# Altium project Pixhawk-BEC-Module.PrjPcb (part 1 of 3)
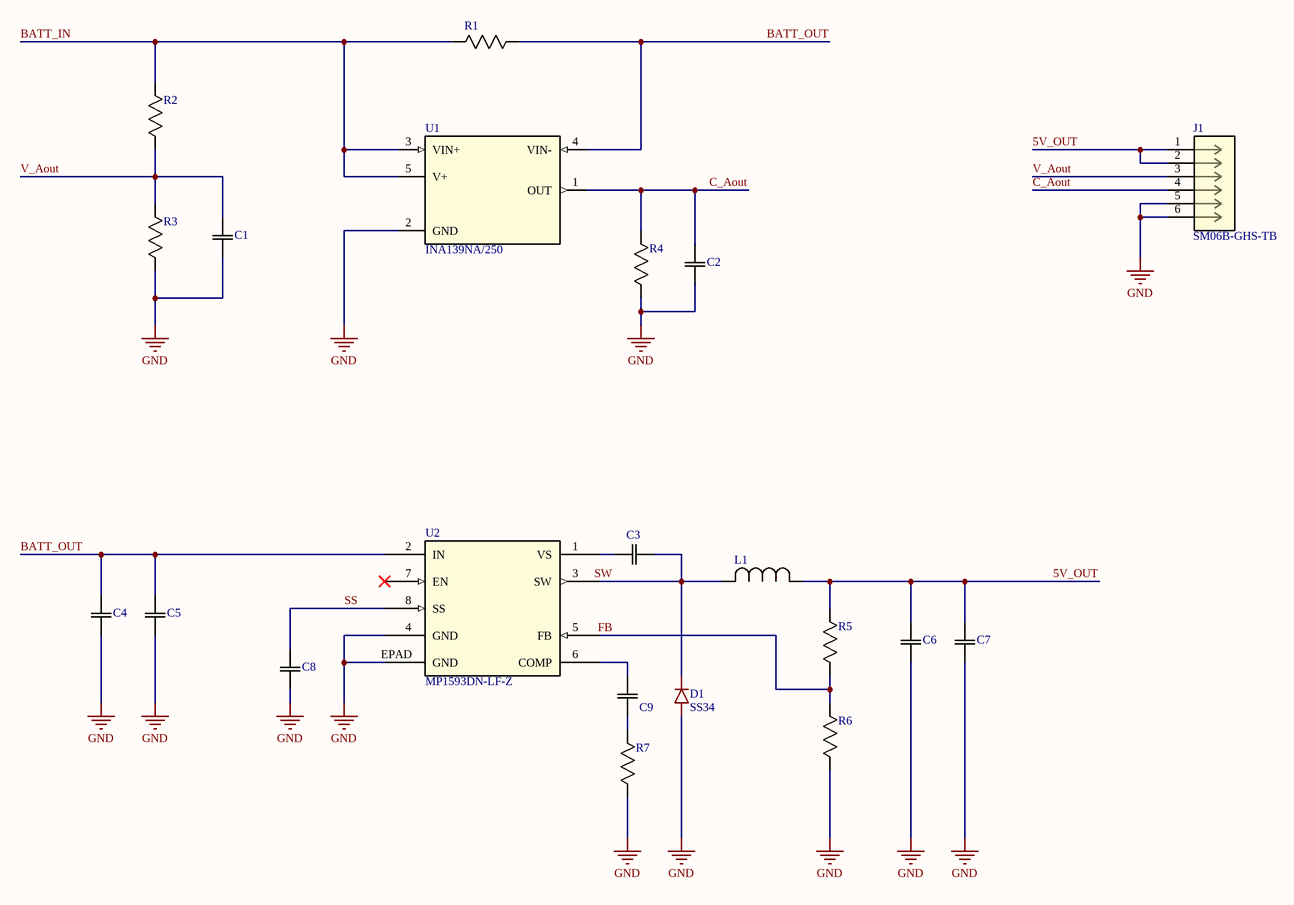
[diagram p0: Sheet1.SchDoc]
1 sheet, 21 parts. Net scope: global (net labels, ports and power ports of the same name join across sheets).
Board file: PCB1.PcbDoc

## Sheet Sheet1.SchDoc
size A3; SheetNumber: 1; SheetTotal: 1

### Parts
C1  CC0402KRX7R9BB104  [CAP_0402]  (value not drawn)
C2  CC0402KRX7R9BB104  [CAP_0402]  (value not drawn)
C3  C0402C103K5RACTU  [CAP_0402]  (value not drawn)
C4  CC1210KKX7R9BB106  [CAP_1210]  (value not drawn)
C5  CC1210KKX7R9BB106  [CAP_1210]  (value not drawn)
C6  GRM32ER71E226ME15L  [CAP_1210]  (value not drawn)
C7  GRM32ER71E226ME15L  [CAP_1210]  (value not drawn)
C8  CC0402KRX7R9BB104  [CAP_0402]  (value not drawn)
C9  C0402C103K5RACTU  [CAP_0402]  (value not drawn)
D1  SS34  [SMB_ONS]
J1  SM06B-GHS-TB  [CONN_SM06B-GHS-TB_JST]
L1  SRR1260-150M  [IND_BOURNS_SRR1260]  (value not drawn)
R1  PA2512FKE7T0U5E  [RES_PA2512_YAG-L]  (value not drawn)
R2  ERJ-2RKF1372X  [RES_0402]  (value not drawn)
R3  ERJ-2GEJ152X  [RES_0402]  (value not drawn)
R4  ERJ-2GEJ104X  [RES_0402]  (value not drawn)
R5  CRGP0402F33K  [RES_0402]  (value not drawn)
R6  CRGP0402F10K  [RES_0402]  (value not drawn)
R7  RK73H1ETTP7501F  [RES_0402]  (value not drawn)
U1  INA139NA/250  [DBV0005A_N]
U2  MP1593DN-LF-Z  [SOIC8E_MNP]

### Nets
GND: C1.1 C2.1 C4.2 C5.1 C6.1 C7.1 C8.1 D1.2(A) J1.5 J1.6 R3.2 R4.2 R6.2 R7.1 U1.2(GND) U2.4(GND) U2.EPAD(GND)
5V_OUT: C6.2 C7.2 J1.1 J1.2 L1.1 R5.1
BATT_IN: R1.1 R2.1 U1.3(VIN+) U1.5(V+)
BATT_OUT: C4.1 C5.2 R1.2 U1.4(VIN-) U2.2(IN)
C_Aout: C2.2 J1.4 R4.1 U1.1(OUT)
FB: R5.2 R6.1 U2.5(FB)
SS: C8.2 U2.8(SS)
SW: C3.2 D1.1(K) L1.2 U2.3(SW)
V_Aout: C1.2 J1.3 R2.2 R3.1
NetC3_1: C3.1 U2.1(VS)
NetC9_1: C9.1 R7.2
NetC9_2: C9.2 U2.6(COMP)

Not connected (* = marked no-connect by the designer): U2 7(EN)*